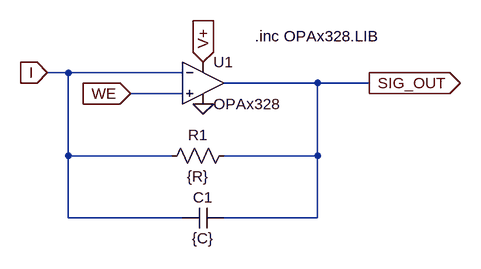
[diagram p0: schematic OPA2328_Trans_Amp.asc]
OPA2328_Trans_Amp.asc, the LTspice schematic file:
Version 4
SHEET 1 880 680
WIRE 32 144 0 144
WIRE 208 144 32 144
WIRE 416 160 272 160
WIRE 496 160 416 160
WIRE 208 176 128 176
WIRE 32 272 32 144
WIRE 192 272 32 272
WIRE 416 272 416 160
WIRE 416 272 272 272
WIRE 32 368 32 272
WIRE 208 368 32 368
WIRE 416 368 416 272
WIRE 416 368 272 368
FLAG 240 192 0
FLAG 240 128 V+
IOPIN 240 128 In
FLAG 128 176 WE
IOPIN 128 176 In
FLAG 0 144 I
IOPIN 0 144 In
FLAG 496 160 SIG_OUT
IOPIN 496 160 Out
SYMBOL OpAmps\\opamp2 240 96 R0
SYMATTR InstName U1
SYMATTR Value OPAx328
SYMBOL res 288 256 R90
WINDOW 0 0 56 VBottom 2
WINDOW 3 32 56 VTop 2
SYMATTR InstName R1
SYMATTR Value {R}
SYMBOL cap 272 352 R90
WINDOW 0 0 32 VBottom 2
WINDOW 3 32 32 VTop 2
SYMATTR InstName C1
SYMATTR Value {C}
TEXT 320 88 Left 2 !.inc OPAx328.LIB

The netlist it stands for:
* OPA2328_Trans_Amp.asc
XU1 WE I V+ 0 SIG_OUT OPAx328  ; pins In+ In- V+ V- OUT
R1 SIG_OUT I {R}
C1 SIG_OUT I {C}
.inc OPAx328.LIB
.backanno
.end